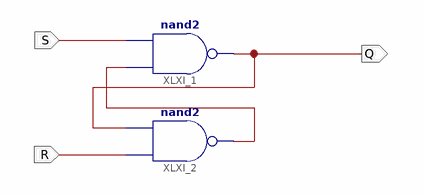
[diagram p0: schematic sheet 1]
// Xilinx ISE schematic rs_nand.sch (spartan6) as structural Verilog: 2 symbols, 3 ports
module rs_nand (
  input  R,
  input  S,
  output Q
);

  wire XLXN_2;

  nand XLXI_1 (Q, XLXN_2, S);
  nand XLXI_2 (XLXN_2, R, Q);
endmodule
